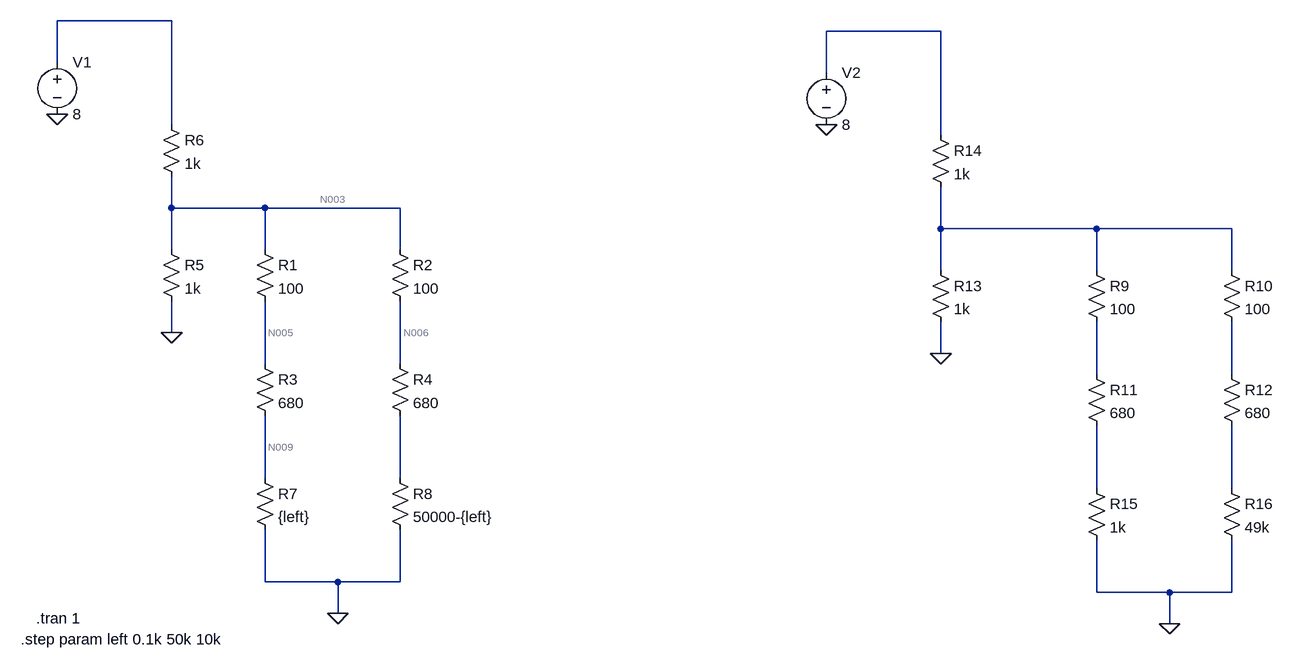
[diagram p0: schematic Carrier Balance.asc]
Carrier Balance.asc, the LTspice schematic file:
Version 4
SHEET 1 1236 696
WIRE -464 -272 -640 -272
WIRE 720 -256 544 -256
WIRE -640 -208 -640 -272
WIRE 544 -192 544 -256
WIRE -464 -112 -464 -272
WIRE 720 -96 720 -256
WIRE -464 16 -464 -32
WIRE -320 16 -464 16
WIRE -112 16 -320 16
WIRE 720 48 720 -16
WIRE 960 48 720 48
WIRE 1168 48 960 48
WIRE -464 80 -464 16
WIRE -320 80 -320 16
WIRE -112 80 -112 16
WIRE 720 112 720 48
WIRE 960 112 960 48
WIRE 1168 112 1168 48
WIRE -464 208 -464 160
WIRE 720 240 720 192
WIRE -320 256 -320 160
WIRE -112 256 -112 160
WIRE 960 272 960 192
WIRE 1168 272 1168 192
WIRE -320 432 -320 336
WIRE -112 432 -112 336
WIRE 960 448 960 352
WIRE 1168 448 1168 352
WIRE -320 592 -320 512
WIRE -208 592 -320 592
WIRE -112 592 -112 512
WIRE -112 592 -208 592
WIRE 960 608 960 528
WIRE 1072 608 960 608
WIRE 1168 608 1168 528
WIRE 1168 608 1072 608
WIRE -208 640 -208 592
WIRE 1072 656 1072 608
FLAG -208 640 0
FLAG -464 208 0
FLAG -640 -128 0
FLAG 1072 656 0
FLAG 720 240 0
FLAG 544 -112 0
SYMBOL res -336 64 R0
SYMATTR InstName R1
SYMATTR Value 100
SYMBOL res -128 64 R0
SYMATTR InstName R2
SYMATTR Value 100
SYMBOL res -336 240 R0
SYMATTR InstName R3
SYMATTR Value 680
SYMBOL res -128 240 R0
SYMATTR InstName R4
SYMATTR Value 680
SYMBOL res -480 64 R0
SYMATTR InstName R5
SYMATTR Value 1k
SYMBOL res -480 -128 R0
SYMATTR InstName R6
SYMATTR Value 1k
SYMBOL voltage -640 -224 R0
WINDOW 123 0 0 Left 0
WINDOW 39 0 0 Left 0
SYMATTR InstName V1
SYMATTR Value 8
SYMBOL res -336 416 R0
SYMATTR InstName R7
SYMATTR Value {left}
SYMBOL res -128 416 R0
SYMATTR InstName R8
SYMATTR Value 50000-{left}
SYMBOL res 944 96 R0
SYMATTR InstName R9
SYMATTR Value 100
SYMBOL res 1152 96 R0
SYMATTR InstName R10
SYMATTR Value 100
SYMBOL res 944 256 R0
SYMATTR InstName R11
SYMATTR Value 680
SYMBOL res 1152 256 R0
SYMATTR InstName R12
SYMATTR Value 680
SYMBOL res 704 96 R0
SYMATTR InstName R13
SYMATTR Value 1k
SYMBOL res 704 -112 R0
SYMATTR InstName R14
SYMATTR Value 1k
SYMBOL voltage 544 -208 R0
WINDOW 123 0 0 Left 0
WINDOW 39 0 0 Left 0
SYMATTR InstName V2
SYMATTR Value 8
SYMBOL res 944 432 R0
SYMATTR InstName R15
SYMATTR Value 1k
SYMBOL res 1152 432 R0
SYMATTR InstName R16
SYMATTR Value 49k
TEXT -672 648 Left 2 !.tran 1
TEXT -696 680 Left 2 !.step param left 0.1k 50k 10k

The netlist it stands for:
* Carrier Balance.asc
R1 N003 N005 100
R2 N003 N006 100
R3 N005 N009 680
R4 N006 N010 680
R5 N003 0 1k
R6 N001 N003 1k
V1 N001 0 8
R7 N009 0 {left}
R8 N010 0 50000-{left}
R9 N004 N007 100
R10 N004 N008 100
R11 N007 N011 680
R12 N008 N012 680
R13 N004 0 1k
R14 N002 N004 1k
V2 N002 0 8
R15 N011 0 1k
R16 N012 0 49k
.tran 1
.step param left 0.1k 50k 10k
.backanno
.end

* Results of the author's LTspice run, read from the files saved beside the schematic
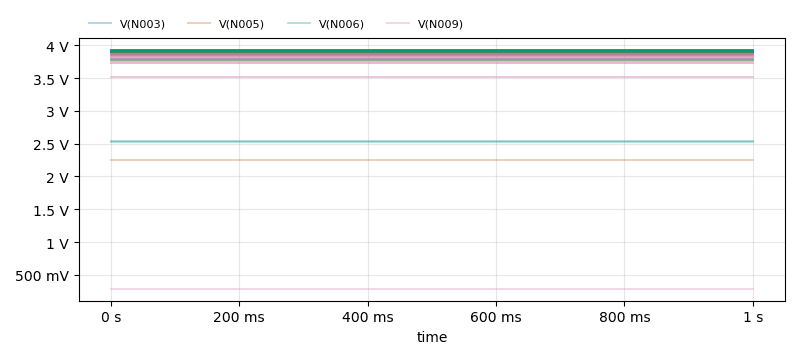
[diagram p1: Transient Analysis of Carrier Balance.asc, plotted from the saved traces]
* Transient Analysis, 6 runs:
*   V(N003) [left=100]: min 2.535 V, max 2.535 V, average 2.535 V, rms 2.535 V, last 2.535 V
*   V(N003) [left=10100]: min 3.789 V, max 3.789 V, average 3.789 V, rms 3.789 V, last 3.789 V
*   V(N003) [left=20100]: min 3.869 V, max 3.869 V, average 3.869 V, rms 3.869 V, last 3.869 V
*   V(N003) [left=30100]: min 3.898 V, max 3.898 V, average 3.898 V, rms 3.898 V, last 3.898 V
*   V(N003) [left=40100]: min 3.914 V, max 3.914 V, average 3.914 V, rms 3.914 V, last 3.914 V
*   V(N003) [left=50000]: min 3.923 V, max 3.923 V, average 3.923 V, rms 3.923 V, last 3.923 V
*   V(N005) [left=100]: min 2.247 V, max 2.247 V, average 2.247 V, rms 2.247 V, last 2.247 V
*   V(N005) [left=10100]: min 3.754 V, max 3.754 V, average 3.754 V, rms 3.754 V, last 3.754 V
*   V(N005) [left=20100]: min 3.851 V, max 3.851 V, average 3.851 V, rms 3.851 V, last 3.851 V
*   V(N005) [left=30100]: min 3.886 V, max 3.886 V, average 3.886 V, rms 3.886 V, last 3.886 V
*   V(N005) [left=40100]: min 3.904 V, max 3.904 V, average 3.904 V, rms 3.904 V, last 3.904 V
*   V(N005) [left=50000]: min 3.915 V, max 3.915 V, average 3.915 V, rms 3.915 V, last 3.915 V
*   V(N006) [left=100]: min 2.53 V, max 2.53 V, average 2.53 V, rms 2.53 V, last 2.53 V
*   V(N006) [left=10100]: min 3.781 V, max 3.781 V, average 3.781 V, rms 3.781 V, last 3.781 V
*   V(N006) [left=20100]: min 3.862 V, max 3.862 V, average 3.862 V, rms 3.862 V, last 3.862 V
*   V(N006) [left=30100]: min 3.891 V, max 3.891 V, average 3.891 V, rms 3.891 V, last 3.891 V
*   V(N006) [left=40100]: min 3.906 V, max 3.906 V, average 3.906 V, rms 3.906 V, last 3.906 V
*   V(N006) [left=50000]: min 3.915 V, max 3.915 V, average 3.915 V, rms 3.915 V, last 3.915 V
*   V(N009) [left=100]: min 288 mV, max 288 mV, average 288 mV, rms 288 mV, last 288 mV
*   V(N009) [left=10100]: min 3.517 V, max 3.517 V, average 3.517 V, rms 3.517 V, last 3.517 V
*   V(N009) [left=20100]: min 3.725 V, max 3.725 V, average 3.725 V, rms 3.725 V, last 3.725 V
*   V(N009) [left=30100]: min 3.8 V, max 3.8 V, average 3.8 V, rms 3.8 V, last 3.8 V
*   V(N009) [left=40100]: min 3.839 V, max 3.839 V, average 3.839 V, rms 3.839 V, last 3.839 V
*   V(N009) [left=50000]: min 3.862 V, max 3.862 V, average 3.862 V, rms 3.862 V, last 3.862 V